# Altium schematic sheet LED_MATRIX_8X16_MONO_R1.SchDoc: LED Matrix 8x16 pixels, Monochrome (RED)
size 508 x 457 mm; Address1: Smoka Wawelskiego 1; Address2: 30-535 Kraków, Poland; DocumentNumber: 1; SheetNumber: 1; SheetTotal: 1; CompanyName: Mirko Electronics; Engineer: M. Folejewski; PageSize: CST; Designators: 1-100
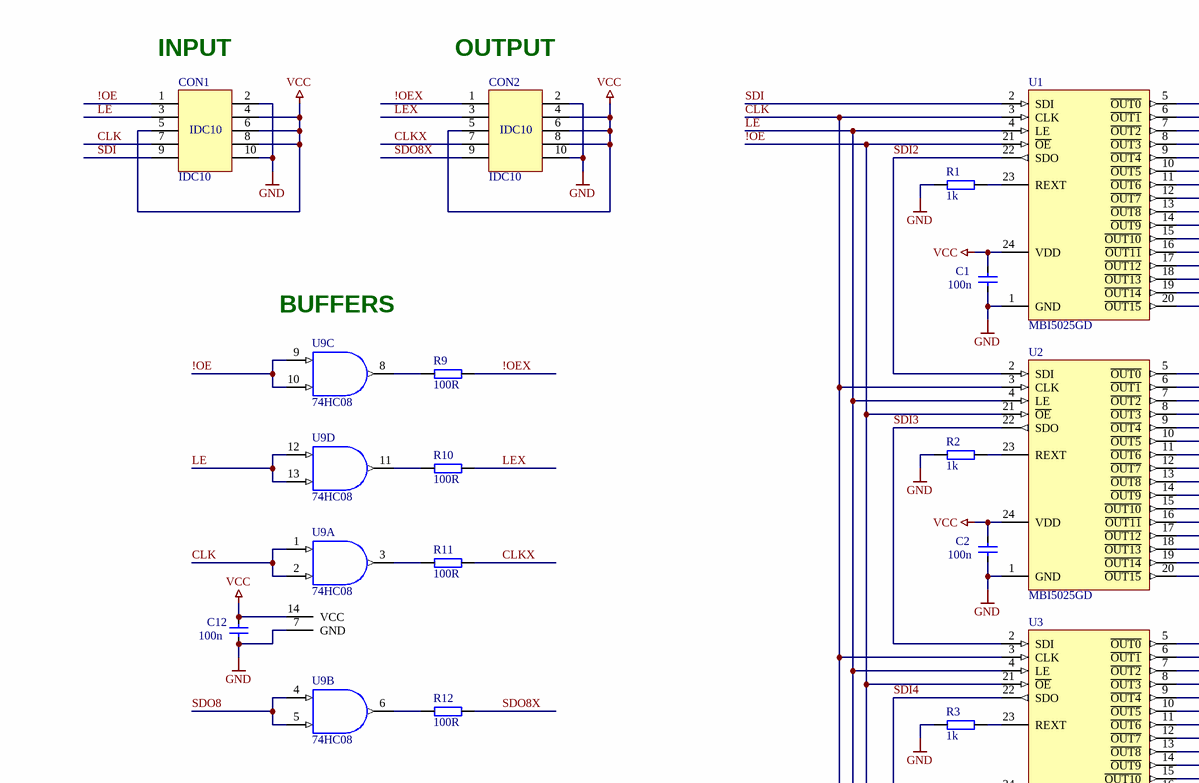
[diagram p0: LED_MATRIX_8X16_MONO_R1.SchDoc, top left]
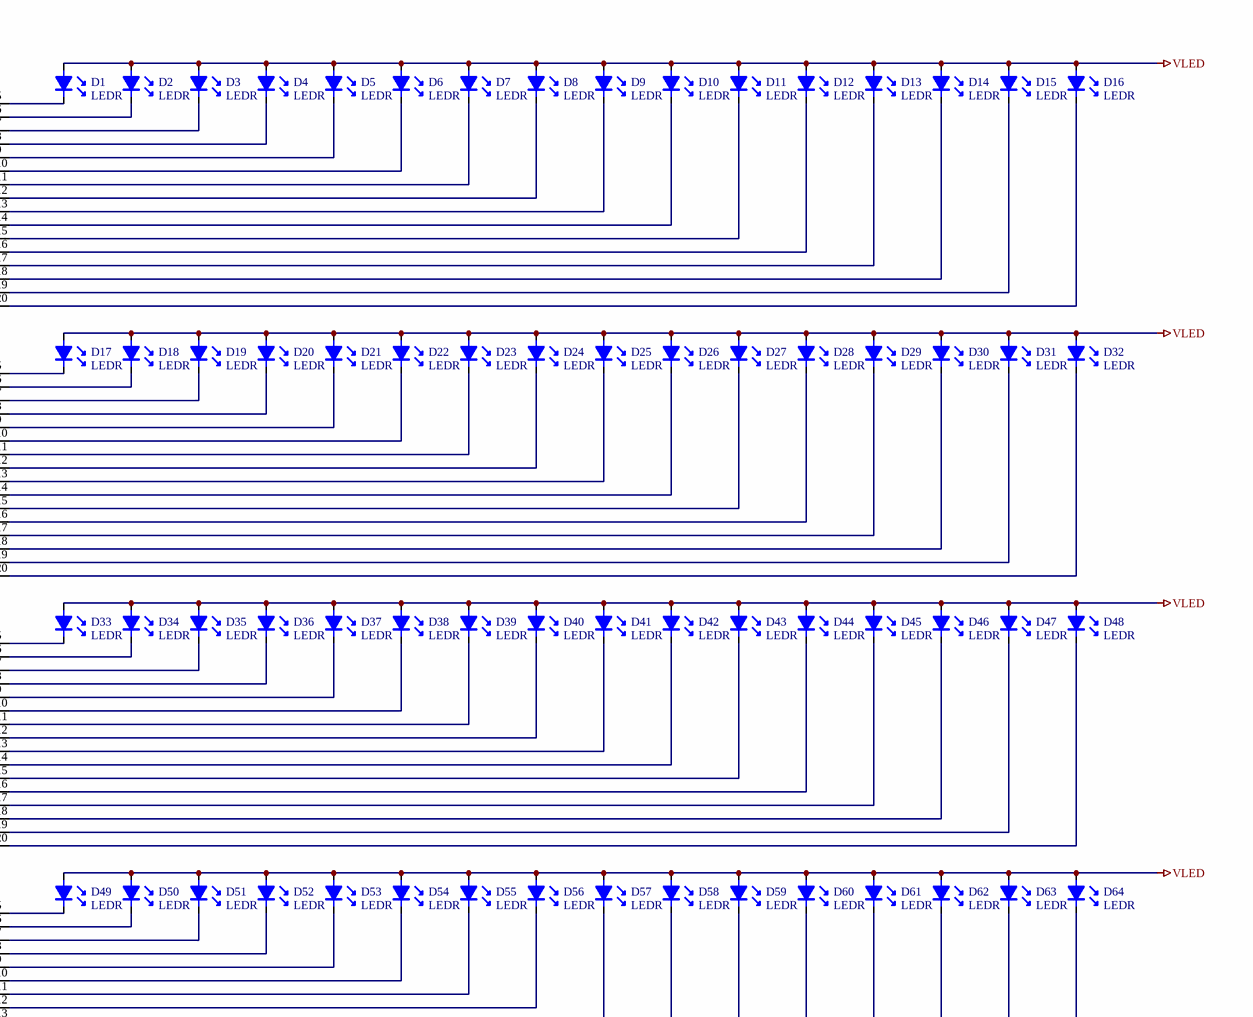
[diagram p1: LED_MATRIX_8X16_MONO_R1.SchDoc, top right]
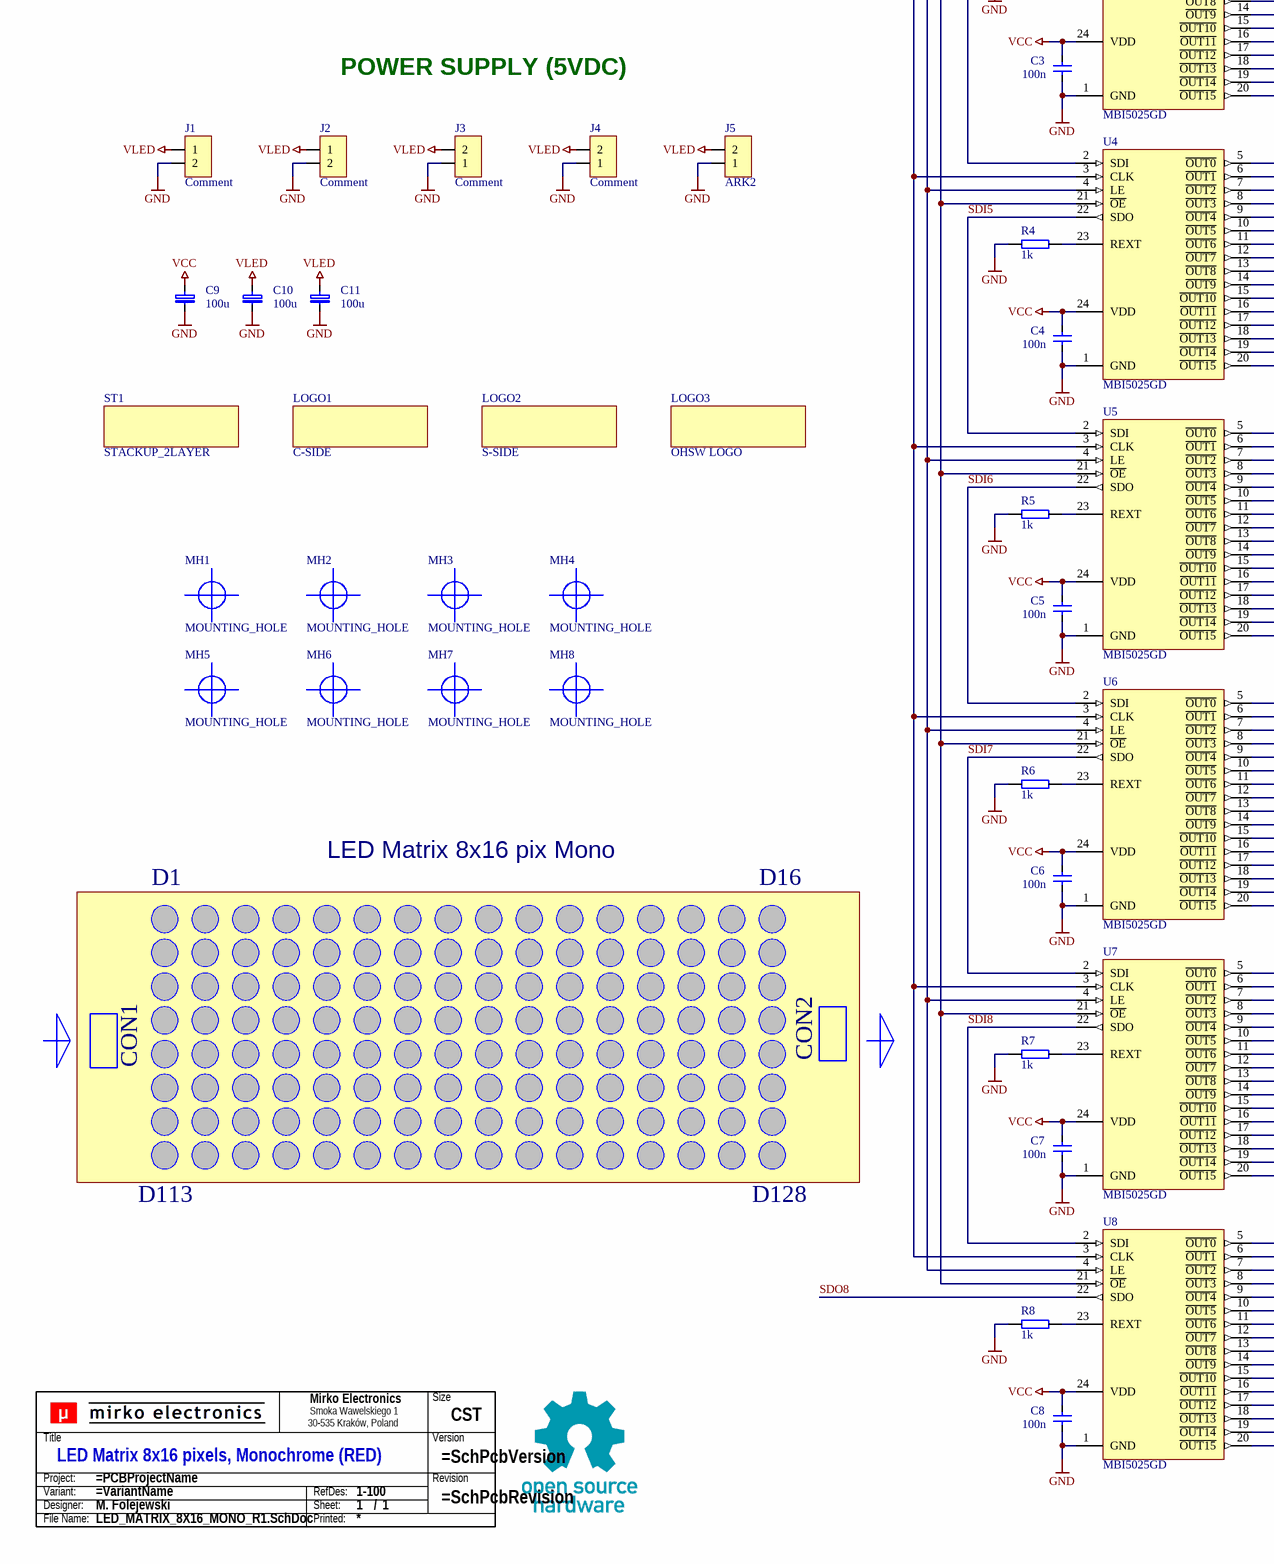
[diagram p2: LED_MATRIX_8X16_MONO_R1.SchDoc, bottom left]
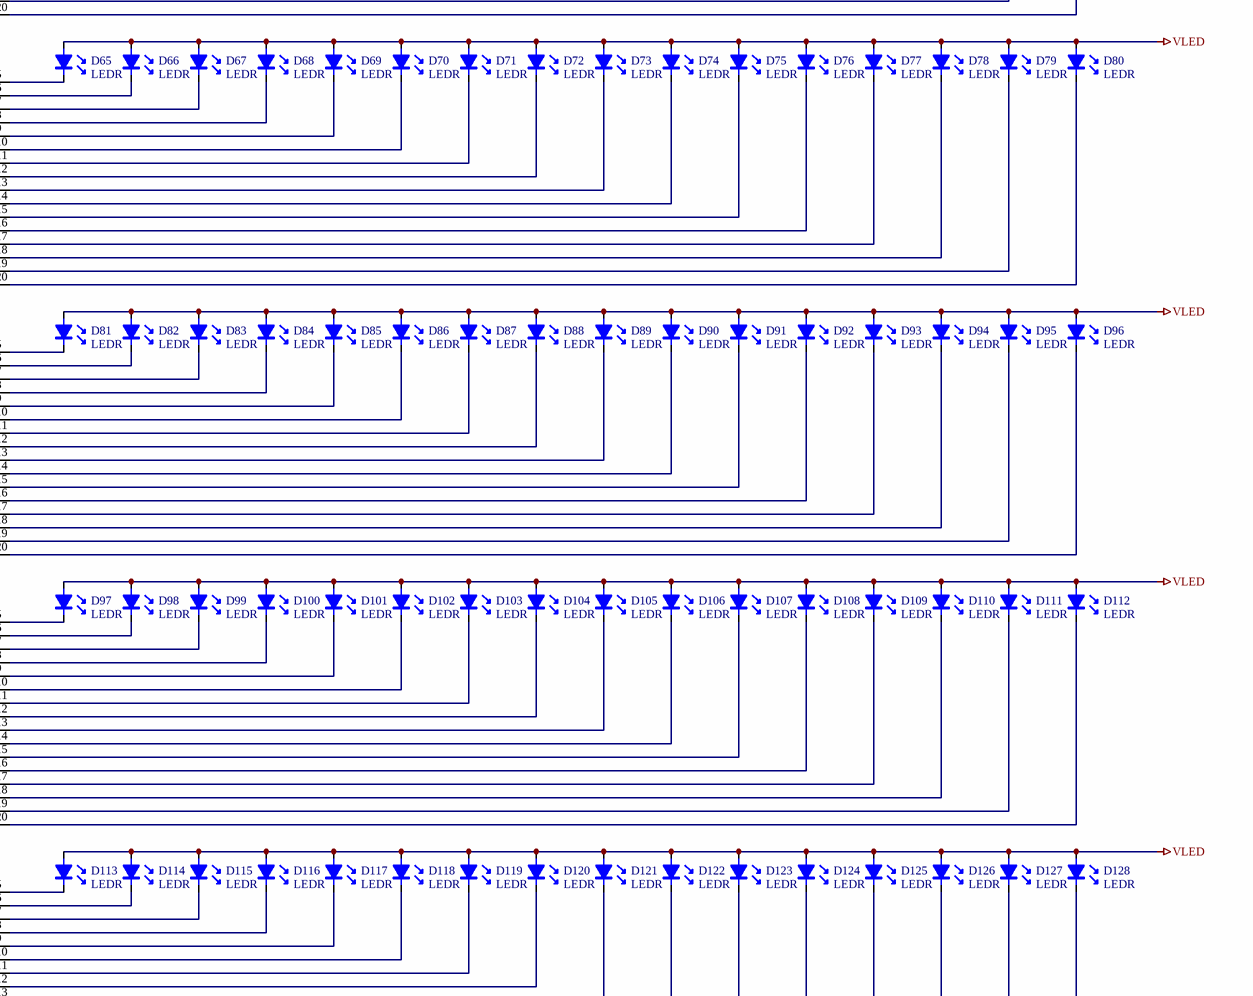
[diagram p3: LED_MATRIX_8X16_MONO_R1.SchDoc, bottom right]

## Parts
C1  100n  [1206]
C2  100n  [1206]
C3  100n  [1206]
C4  100n  [1206]
C5  100n  [1206]
C6  100n  [1206]
C7  100n  [1206]
C8  100n  [1206]
C9  100u  [CAP_POL_R3.5MM]
C10  100u  [CAP_POL_R3.5MM]
C11  100u  [CAP_POL_R3.5MM]
C12  100n  [1206]
CON1  IDC10  [IDC10]
CON2  IDC10  [IDC10]
D1  LEDR  [LED_MTX-4]
D2  LEDR  [LED_MTX]
D3  LEDR  [LED_MTX]
D4  LEDR  [LED_MTX]
D5  LEDR  [LED_MTX]
D6  LEDR  [LED_MTX]
D7  LEDR  [LED_MTX]
D8  LEDR  [LED_MTX]
D9  LEDR  [LED_MTX]
D10  LEDR  [LED_MTX]
D11  LEDR  [LED_MTX]
D12  LEDR  [LED_MTX]
D13  LEDR  [LED_MTX]
D14  LEDR  [LED_MTX]
D15  LEDR  [LED_MTX]
D16  LEDR  [LED_MTX]
D17  LEDR  [LED_MTX-2]
D18  LEDR  [LED_MTX]
D19  LEDR  [LED_MTX]
D20  LEDR  [LED_MTX]
D21  LEDR  [LED_MTX]
D22  LEDR  [LED_MTX]
D23  LEDR  [LED_MTX]
D24  LEDR  [LED_MTX]
D25  LEDR  [LED_MTX-2]
D26  LEDR  [LED_MTX]
D27  LEDR  [LED_MTX]
D28  LEDR  [LED_MTX]
D29  LEDR  [LED_MTX]
D30  LEDR  [LED_MTX]
D31  LEDR  [LED_MTX]
D32  LEDR  [LED_MTX]
D33  LEDR  [LED_MTX-2]
D34  LEDR  [LED_MTX]
D35  LEDR  [LED_MTX]
D36  LEDR  [LED_MTX]
D37  LEDR  [LED_MTX]
D38  LEDR  [LED_MTX]
D39  LEDR  [LED_MTX]
D40  LEDR  [LED_MTX]
D41  LEDR  [LED_MTX-2]
D42  LEDR  [LED_MTX]
D43  LEDR  [LED_MTX]
D44  LEDR  [LED_MTX]
D45  LEDR  [LED_MTX]
D46  LEDR  [LED_MTX]
D47  LEDR  [LED_MTX]
D48  LEDR  [LED_MTX]
D49  LEDR  [LED_MTX-2]
D50  LEDR  [LED_MTX]
D51  LEDR  [LED_MTX]
D52  LEDR  [LED_MTX]
D53  LEDR  [LED_MTX]
D54  LEDR  [LED_MTX]
D55  LEDR  [LED_MTX]
D56  LEDR  [LED_MTX]
D57  LEDR  [LED_MTX-2]
D58  LEDR  [LED_MTX]
D59  LEDR  [LED_MTX]
D60  LEDR  [LED_MTX]
D61  LEDR  [LED_MTX]
D62  LEDR  [LED_MTX]
D63  LEDR  [LED_MTX]
D64  LEDR  [LED_MTX]
D65  LEDR  [LED_MTX-3]
D66  LEDR  [LED_MTX]
D67  LEDR  [LED_MTX]
D68  LEDR  [LED_MTX]
D69  LEDR  [LED_MTX]
D70  LEDR  [LED_MTX]
D71  LEDR  [LED_MTX]
D72  LEDR  [LED_MTX]
D73  LEDR  [LED_MTX-3]
D74  LEDR  [LED_MTX]
D75  LEDR  [LED_MTX]
D76  LEDR  [LED_MTX]
D77  LEDR  [LED_MTX]
D78  LEDR  [LED_MTX]
D79  LEDR  [LED_MTX]
D80  LEDR  [LED_MTX]
D81  LEDR  [LED_MTX-2]
D82  LEDR  [LED_MTX]
D83  LEDR  [LED_MTX]
D84  LEDR  [LED_MTX]
D85  LEDR  [LED_MTX]
D86  LEDR  [LED_MTX]
D87  LEDR  [LED_MTX]
D88  LEDR  [LED_MTX]
D89  LEDR  [LED_MTX-2]
D90  LEDR  [LED_MTX]
D91  LEDR  [LED_MTX]
D92  LEDR  [LED_MTX]
D93  LEDR  [LED_MTX]
D94  LEDR  [LED_MTX]
D95  LEDR  [LED_MTX]
D96  LEDR  [LED_MTX]
D97  LEDR  [LED_MTX-2]
D98  LEDR  [LED_MTX]
D99  LEDR  [LED_MTX]
D100  LEDR  [LED_MTX]
D101  LEDR  [LED_MTX]
D102  LEDR  [LED_MTX]
D103  LEDR  [LED_MTX]
D104  LEDR  [LED_MTX]
D105  LEDR  [LED_MTX-2]
D106  LEDR  [LED_MTX]
D107  LEDR  [LED_MTX]
D108  LEDR  [LED_MTX]
D109  LEDR  [LED_MTX]
D110  LEDR  [LED_MTX]
D111  LEDR  [LED_MTX]
D112  LEDR  [LED_MTX]
D113  LEDR  [LED_MTX-5]
D114  LEDR  [LED_MTX]
D115  LEDR  [LED_MTX]
D116  LEDR  [LED_MTX]
D117  LEDR  [LED_MTX]
D118  LEDR  [LED_MTX]
D119  LEDR  [LED_MTX]
D120  LEDR  [LED_MTX]
D121  LEDR  [LED_MTX]
D122  LEDR  [LED_MTX]
D123  LEDR  [LED_MTX]
D124  LEDR  [LED_MTX]
D125  LEDR  [LED_MTX]
D126  LEDR  [LED_MTX]
D127  LEDR  [LED_MTX]
D128  LEDR  [LED_MTX]
J1  Comment  [WAGO2X2-5]
J2  Comment  [WAGO2X2-5]
J3  Comment  [WAGO2X2-5]
J4  Comment  [WAGO2X2-5]
J5  ARK2  [ARK2_R5MM]
LOGO1  C-SIDE  [COMPONENT_SIDE]
LOGO2  S-SIDE  [SOLDER_SIDE]
LOGO3  OHSW LOGO  [PCB_OSHW_LOGO_1000]
MH1  MOUNTING_HOLE  [MH_3.2]
MH2  MOUNTING_HOLE  [MH_3.2]
MH3  MOUNTING_HOLE  [MH_3.2]
MH4  MOUNTING_HOLE  [MH_3.2]
MH5  MOUNTING_HOLE  [MH_3.2]
MH6  MOUNTING_HOLE  [MH_3.2]
MH7  MOUNTING_HOLE  [MH_3.2]
MH8  MOUNTING_HOLE  [MH_3.2]
R1  1k  [1206]
R2  1k  [1206]
R3  1k  [1206]
R4  1k  [1206]
R5  1k  [1206]
R6  1k  [1206]
R7  1k  [1206]
R8  1k  [1206]
R9  100R  [0805]
R10  100R  [0805]
R11  100R  [0805]
R12  100R  [0805]
ST1  STACKUP_2LAYER  [STACKUP_2LAYER]
TB?  Title block  (value not drawn)  (graphical)
U1  MBI5025GD  [SOP24]
U2  MBI5025GD  [SOP24]
U3  MBI5025GD  [SOP24]
U4  MBI5025GD  [SOP24]
U5  MBI5025GD  [SOP24]
U6  MBI5025GD  [SOP24]
U7  MBI5025GD  [SOP24]
U8  MBI5025GD  [SOP24]
U9  74HC08  [SO-14]  (parts A,B,C,D of 4)

## Nets
GND: C1.2 C2.2 C3.2 C4.2 C5.2 C6.2 C7.2 C8.2 C9.2 C10.2 C11.2 C12.2 CON1.2 CON1.10 CON2.2 CON2.10 J1.2 J2.2 J3.1 J4.1 J5.1 R1.2 R2.2 R3.2 R4.2 R5.2 R6.2 R7.2 R8.2 U1.1(GND) U2.1(GND) U3.1(GND) U4.1(GND) U5.1(GND) U6.1(GND) U7.1(GND) U8.1(GND) U9.7(GND)
VCC: C1.1 C2.1 C3.1 C4.1 C5.1 C6.1 C7.1 C8.1 C9.1 C12.1 CON1.4 CON1.5 CON1.6 CON1.8 CON2.4 CON2.5 CON2.6 CON2.8 U1.24(VDD) U2.24(VDD) U3.24(VDD) U4.24(VDD) U5.24(VDD) U6.24(VDD) U7.24(VDD) U8.24(VDD) U9.14(VCC)
VLED: C10.1 C11.1 D1.1 D2.1 D3.1 D4.1 D5.1 D6.1 D7.1 D8.1 D9.1 D10.1 D11.1 D12.1 D13.1 D14.1 D15.1 D16.1 D17.1 D18.1 D19.1 D20.1 D21.1 D22.1 D23.1 D24.1 D25.1 D26.1 D27.1 D28.1 D29.1 D30.1 D31.1 D32.1 D33.1 D34.1 D35.1 D36.1 D37.1 D38.1 D39.1 D40.1 D41.1 D42.1 D43.1 D44.1 D45.1 D46.1 D47.1 D48.1 D49.1 D50.1 D51.1 D52.1 D53.1 D54.1 D55.1 D56.1 D57.1 D58.1 D59.1 D60.1 D61.1 D62.1 D63.1 D64.1 D65.1 D66.1 D67.1 D68.1 D69.1 D70.1 D71.1 D72.1 D73.1 D74.1 D75.1 D76.1 D77.1 D78.1 D79.1 D80.1 D81.1 D82.1 D83.1 D84.1 D85.1 D86.1 D87.1 D88.1 D89.1 D90.1 D91.1 D92.1 D93.1 D94.1 D95.1 D96.1 D97.1 D98.1 D99.1 D100.1 D101.1 D102.1 D103.1 D104.1 D105.1 D106.1 D107.1 D108.1 D109.1 D110.1 D111.1 D112.1 D113.1 D114.1 D115.1 D116.1 D117.1 D118.1 D119.1 D120.1 D121.1 D122.1 D123.1 D124.1 D125.1 D126.1 D127.1 D128.1 J1.1 J2.1 J3.2 J4.2 J5.2
!OE: CON1.1 U1.21(~{OE}) U2.21(~{OE}) U3.21(~{OE}) U4.21(~{OE}) U5.21(~{OE}) U6.21(~{OE}) U7.21(~{OE}) U8.21(~{OE}) U9.9(A) U9.10(B)
!OEX: CON2.1 R9.2
CLK: CON1.7 U1.3(CLK) U2.3(CLK) U3.3(CLK) U4.3(CLK) U5.3(CLK) U6.3(CLK) U7.3(CLK) U8.3(CLK) U9.1(A) U9.2(B)
CLKX: CON2.7 R11.2
LE: CON1.3 U1.4(LE) U2.4(LE) U3.4(LE) U4.4(LE) U5.4(LE) U6.4(LE) U7.4(LE) U8.4(LE) U9.12(A) U9.13(B)
LEX: CON2.3 R10.2
SDI: CON1.9 U1.2(SDI)
SDI2: U1.22(SDO) U2.2(SDI)
SDI3: U2.22(SDO) U3.2(SDI)
SDI4: U3.22(SDO) U4.2(SDI)
SDI5: U4.22(SDO) U5.2(SDI)
SDI6: U5.22(SDO) U6.2(SDI)
SDI7: U6.22(SDO) U7.2(SDI)
SDI8: U7.22(SDO) U8.2(SDI)
SDO8: U8.22(SDO) U9.4(A) U9.5(B)
SDO8X: CON2.9 R12.2
NetD1_2: D1.2 U1.5(~{OUT0})
NetD2_2: D2.2 U1.6(~{OUT1})
NetD3_2: D3.2 U1.7(~{OUT2})
NetD4_2: D4.2 U1.8(~{OUT3})
NetD5_2: D5.2 U1.9(~{OUT4})
NetD6_2: D6.2 U1.10(~{OUT5})
NetD7_2: D7.2 U1.11(~{OUT6})
NetD8_2: D8.2 U1.12(~{OUT7})
NetD9_2: D9.2 U1.13(~{OUT8})
NetD10_2: D10.2 U1.14(~{OUT9})
NetD11_2: D11.2 U1.15(~{OUT10})
NetD12_2: D12.2 U1.16(~{OUT11})
NetD13_2: D13.2 U1.17(~{OUT12})
NetD14_2: D14.2 U1.18(~{OUT13})
NetD15_2: D15.2 U1.19(~{OUT14})
NetD16_2: D16.2 U1.20(~{OUT15})
NetD17_2: D17.2 U2.5(~{OUT0})
NetD18_2: D18.2 U2.6(~{OUT1})
NetD19_2: D19.2 U2.7(~{OUT2})
NetD20_2: D20.2 U2.8(~{OUT3})
NetD21_2: D21.2 U2.9(~{OUT4})
NetD22_2: D22.2 U2.10(~{OUT5})
NetD23_2: D23.2 U2.11(~{OUT6})
NetD24_2: D24.2 U2.12(~{OUT7})
NetD25_2: D25.2 U2.13(~{OUT8})
NetD26_2: D26.2 U2.14(~{OUT9})
NetD27_2: D27.2 U2.15(~{OUT10})
NetD28_2: D28.2 U2.16(~{OUT11})
NetD29_2: D29.2 U2.17(~{OUT12})
NetD30_2: D30.2 U2.18(~{OUT13})
NetD31_2: D31.2 U2.19(~{OUT14})
NetD32_2: D32.2 U2.20(~{OUT15})
NetD33_2: D33.2 U3.5(~{OUT0})
NetD34_2: D34.2 U3.6(~{OUT1})
NetD35_2: D35.2 U3.7(~{OUT2})
NetD36_2: D36.2 U3.8(~{OUT3})
NetD37_2: D37.2 U3.9(~{OUT4})
NetD38_2: D38.2 U3.10(~{OUT5})
NetD39_2: D39.2 U3.11(~{OUT6})
NetD40_2: D40.2 U3.12(~{OUT7})
NetD41_2: D41.2 U3.13(~{OUT8})
NetD42_2: D42.2 U3.14(~{OUT9})
NetD43_2: D43.2 U3.15(~{OUT10})
NetD44_2: D44.2 U3.16(~{OUT11})
NetD45_2: D45.2 U3.17(~{OUT12})
NetD46_2: D46.2 U3.18(~{OUT13})
NetD47_2: D47.2 U3.19(~{OUT14})
NetD48_2: D48.2 U3.20(~{OUT15})
NetD49_2: D49.2 U4.5(~{OUT0})
NetD50_2: D50.2 U4.6(~{OUT1})
NetD51_2: D51.2 U4.7(~{OUT2})
NetD52_2: D52.2 U4.8(~{OUT3})
NetD53_2: D53.2 U4.9(~{OUT4})
NetD54_2: D54.2 U4.10(~{OUT5})
NetD55_2: D55.2 U4.11(~{OUT6})
NetD56_2: D56.2 U4.12(~{OUT7})
NetD57_2: D57.2 U4.13(~{OUT8})
NetD58_2: D58.2 U4.14(~{OUT9})
NetD59_2: D59.2 U4.15(~{OUT10})
NetD60_2: D60.2 U4.16(~{OUT11})
NetD61_2: D61.2 U4.17(~{OUT12})
NetD62_2: D62.2 U4.18(~{OUT13})
NetD63_2: D63.2 U4.19(~{OUT14})
NetD64_2: D64.2 U4.20(~{OUT15})
NetD65_2: D65.2 U5.5(~{OUT0})
NetD66_2: D66.2 U5.6(~{OUT1})
NetD67_2: D67.2 U5.7(~{OUT2})
NetD68_2: D68.2 U5.8(~{OUT3})
NetD69_2: D69.2 U5.9(~{OUT4})
NetD70_2: D70.2 U5.10(~{OUT5})
NetD71_2: D71.2 U5.11(~{OUT6})
NetD72_2: D72.2 U5.12(~{OUT7})
NetD73_2: D73.2 U5.13(~{OUT8})
NetD74_2: D74.2 U5.14(~{OUT9})
NetD75_2: D75.2 U5.15(~{OUT10})
NetD76_2: D76.2 U5.16(~{OUT11})
NetD77_2: D77.2 U5.17(~{OUT12})
NetD78_2: D78.2 U5.18(~{OUT13})
NetD79_2: D79.2 U5.19(~{OUT14})
NetD80_2: D80.2 U5.20(~{OUT15})
NetD81_2: D81.2 U6.5(~{OUT0})
NetD82_2: D82.2 U6.6(~{OUT1})
NetD83_2: D83.2 U6.7(~{OUT2})
NetD84_2: D84.2 U6.8(~{OUT3})
NetD85_2: D85.2 U6.9(~{OUT4})
NetD86_2: D86.2 U6.10(~{OUT5})
NetD87_2: D87.2 U6.11(~{OUT6})
NetD88_2: D88.2 U6.12(~{OUT7})
NetD89_2: D89.2 U6.13(~{OUT8})
NetD90_2: D90.2 U6.14(~{OUT9})
NetD91_2: D91.2 U6.15(~{OUT10})
NetD92_2: D92.2 U6.16(~{OUT11})
NetD93_2: D93.2 U6.17(~{OUT12})
NetD94_2: D94.2 U6.18(~{OUT13})
NetD95_2: D95.2 U6.19(~{OUT14})
NetD96_2: D96.2 U6.20(~{OUT15})
NetD97_2: D97.2 U7.5(~{OUT0})
NetD98_2: D98.2 U7.6(~{OUT1})
NetD99_2: D99.2 U7.7(~{OUT2})
NetD100_2: D100.2 U7.8(~{OUT3})
NetD101_2: D101.2 U7.9(~{OUT4})
NetD102_2: D102.2 U7.10(~{OUT5})
NetD103_2: D103.2 U7.11(~{OUT6})
NetD104_2: D104.2 U7.12(~{OUT7})
NetD105_2: D105.2 U7.13(~{OUT8})
NetD106_2: D106.2 U7.14(~{OUT9})
NetD107_2: D107.2 U7.15(~{OUT10})
NetD108_2: D108.2 U7.16(~{OUT11})
NetD109_2: D109.2 U7.17(~{OUT12})
NetD110_2: D110.2 U7.18(~{OUT13})
NetD111_2: D111.2 U7.19(~{OUT14})
NetD112_2: D112.2 U7.20(~{OUT15})
NetD113_2: D113.2 U8.5(~{OUT0})
NetD114_2: D114.2 U8.6(~{OUT1})
NetD115_2: D115.2 U8.7(~{OUT2})
NetD116_2: D116.2 U8.8(~{OUT3})
NetD117_2: D117.2 U8.9(~{OUT4})
NetD118_2: D118.2 U8.10(~{OUT5})
NetD119_2: D119.2 U8.11(~{OUT6})
NetD120_2: D120.2 U8.12(~{OUT7})
NetD121_2: D121.2 U8.13(~{OUT8})
NetD122_2: D122.2 U8.14(~{OUT9})
NetD123_2: D123.2 U8.15(~{OUT10})
NetD124_2: D124.2 U8.16(~{OUT11})
NetD125_2: D125.2 U8.17(~{OUT12})
NetD126_2: D126.2 U8.18(~{OUT13})
NetD127_2: D127.2 U8.19(~{OUT14})
NetD128_2: D128.2 U8.20(~{OUT15})
NetR1_1: R1.1 U1.23(REXT)
NetR2_1: R2.1 U2.23(REXT)
NetR3_1: R3.1 U3.23(REXT)
NetR4_1: R4.1 U4.23(REXT)
NetR5_1: R5.1 U5.23(REXT)
NetR6_1: R6.1 U6.23(REXT)
NetR7_1: R7.1 U7.23(REXT)
NetR8_1: R8.1 U8.23(REXT)
NetR9_1: R9.1 U9.8(Y)
NetR10_1: R10.1 U9.11(Y)
NetR11_1: R11.1 U9.3(Y)
NetR12_1: R12.1 U9.6(Y)

## Notes on the sheet
- (near CON1) INPUT
- (near CON2) OUTPUT
- (near U9) BUFFERS
- POWER SUPPLY (5VDC)
- D1
- LED Matrix 8x16 pix Mono
- D16
- CON2
- CON1
- D113
- D128
- (in symbol SCH_TITLE_BLOCK_V1) Size; Title; Version; Project:; Revision; Variant:; RefDes:; Designer:; Sheet:; /; File Name:; Printed:

## Library data of the parts
C1-C8 C12 = CAP
C9-C11 = CAP_EL_SMD: KONDENSATOR ELEKTROLITYCZNY SMD
D1-D128 = LED
J1-J5 = CON2: Connector
LOGO1-LOGO3 ST1 = STACKUP_2LAYER: STACKUP 2 LAYER
MH1-MH8 = MOUNTING_HOLE: Mounting Hole
R1-R12 = R0805
TB? = SCH_TITLE_BLOCK_V1: Component Type: Title block; Manufacturer: -; Mounting Type: Non component; MPN: -; Operating Temperature: -; Package: -; Specification: Title block; Value: Title block; Replacement: -; System: ?
U1-U8 = MBI5025GD: 16-channel Constant Current LED Sink Driver
U9 = 74AC08: Quadruple 2-Input Positive-AND Gate